# Altium project B106AA.PrjPcb (part 1 of 5)
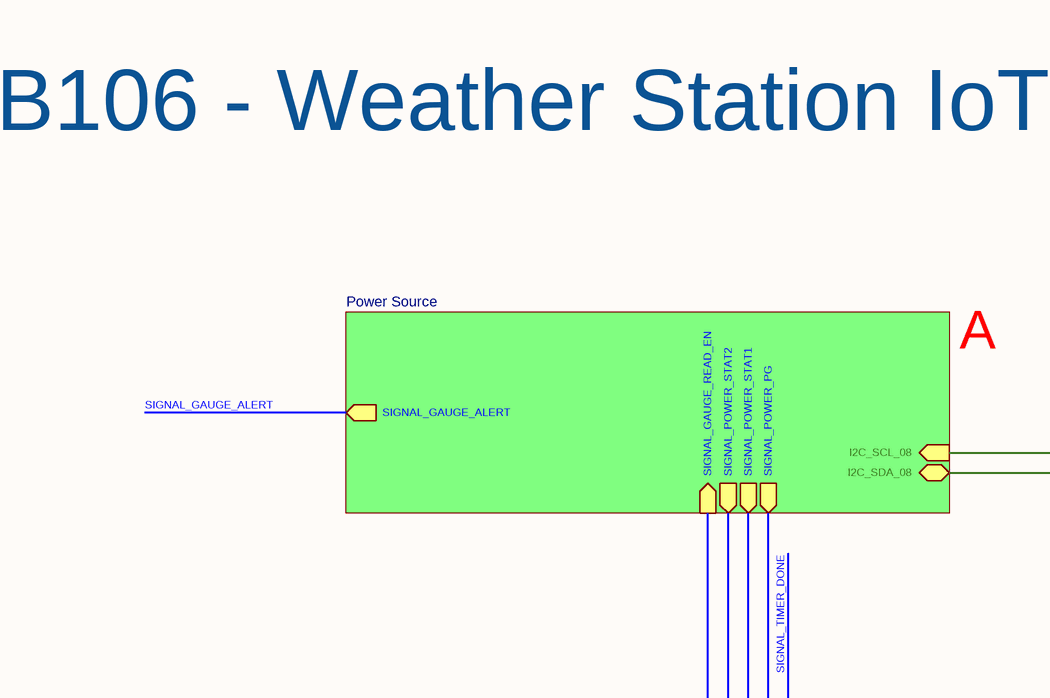
[diagram p0: B106AA Block Diagram.SchDoc, top left]
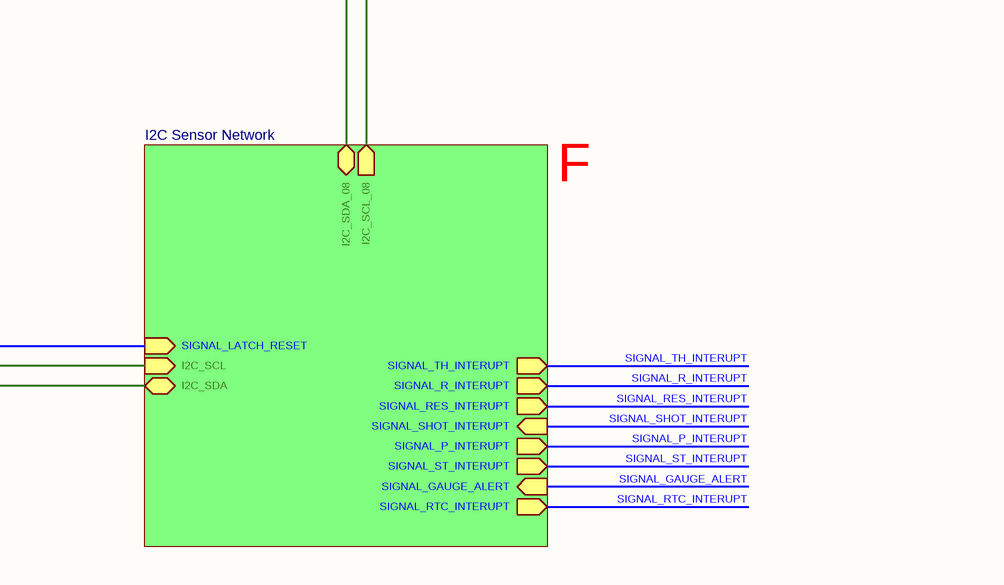
[diagram p1: B106AA Block Diagram.SchDoc, top right]
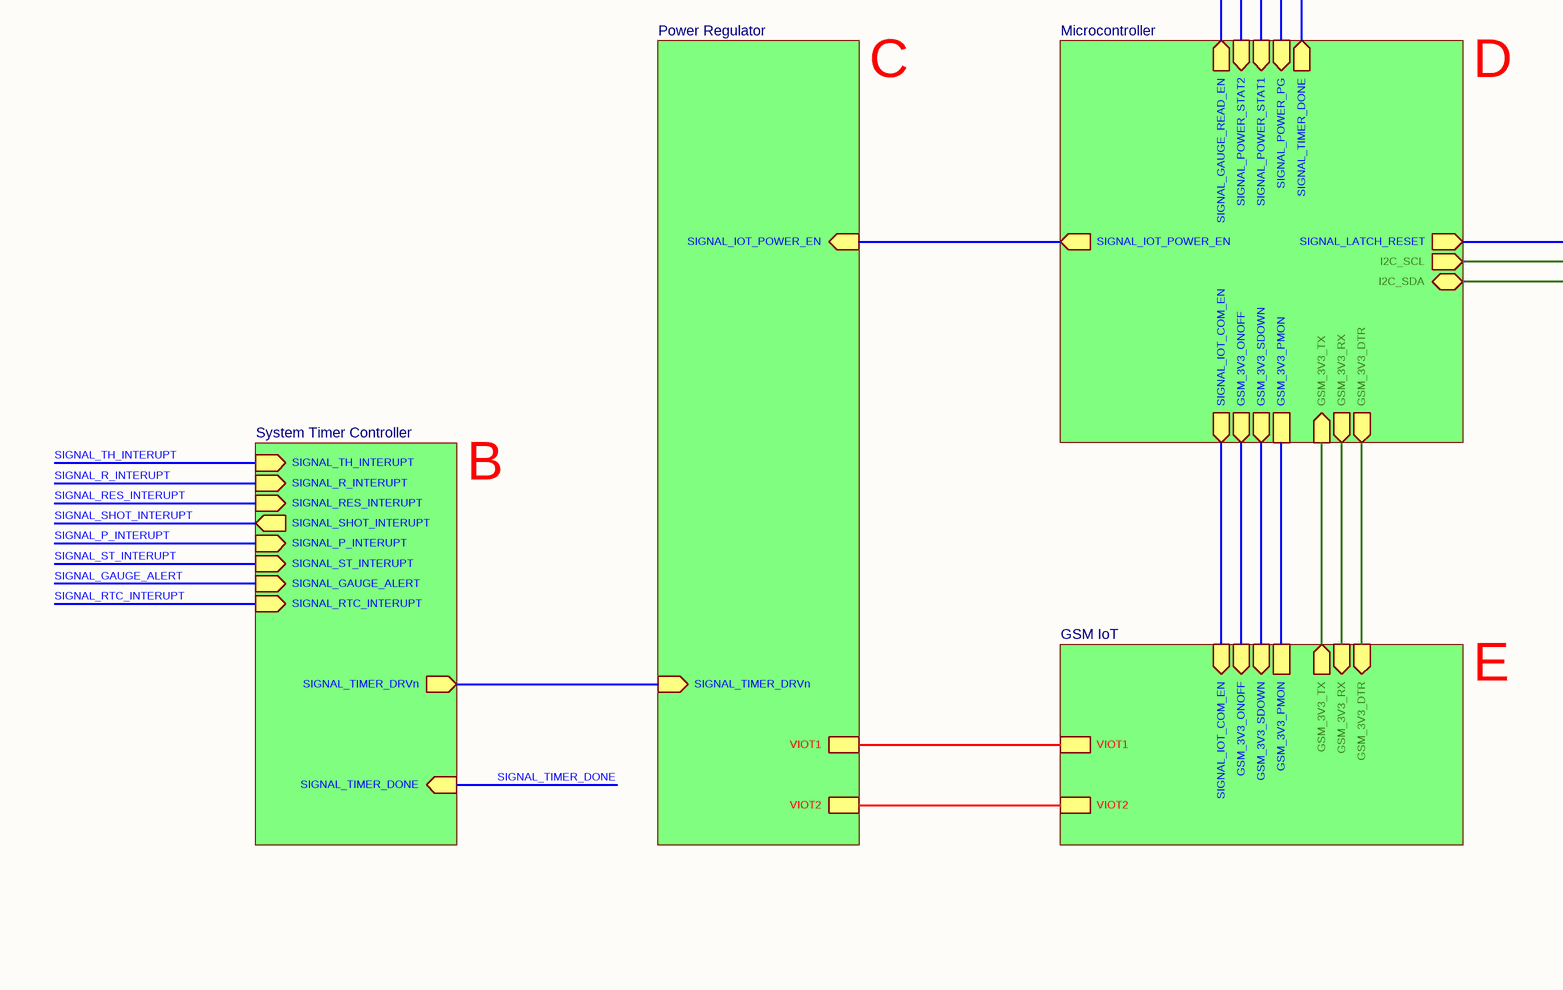
[diagram p2: B106AA Block Diagram.SchDoc, bottom left]
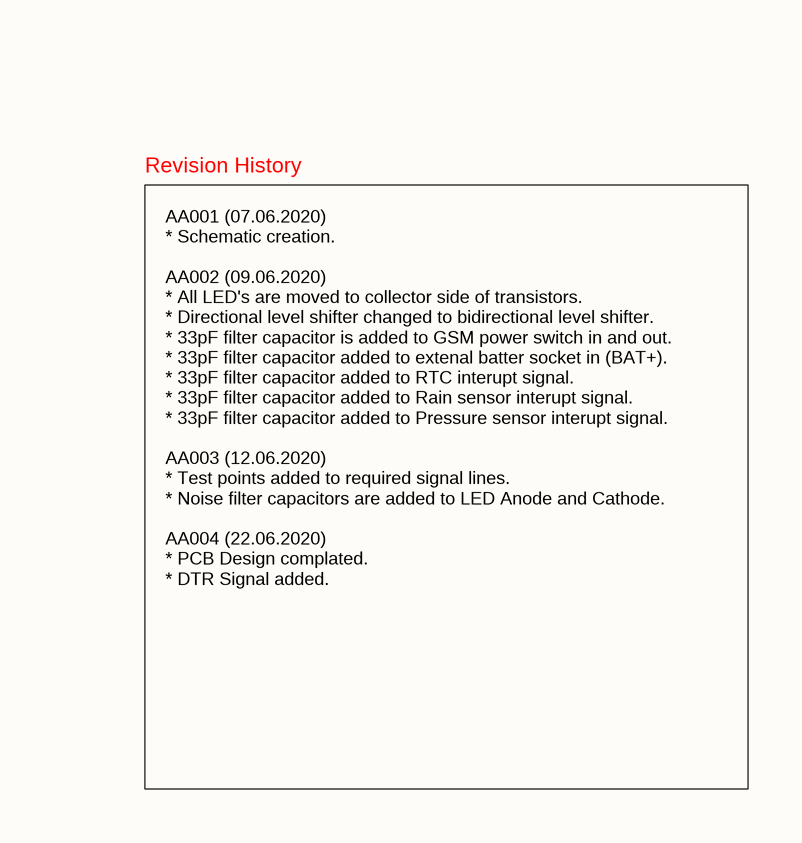
[diagram p3: B106AA Block Diagram.SchDoc, bottom right]
Address1_: Küçük Ýhsaniye Mah.; Address2_: Mýzraklý Sok. No:15; Address3_: Meram / Konya; Address4_: Turkiye; DocumentNumber_: AA005; DocumentNumber_Bulk_: AA005_Bulk; DocumentNumber_Prototype_: AA005_Prototype; Engineer_: Mehmet Günce Akkoyun; link: http://www.ovoo.me; Organization_: Ovoo Electronics; Revision_: B106AA
37 sheets, 383 parts. Net scope: hierarchical (ports join the sheet entries above them; power ports are global).
Board file: B106AA.PcbDoc
Sheets:
  B106AA Block Diagram.SchDoc
    Microcontroller = Microcontroller.SchDoc
      Master MicroController = Master MicroController.SchDoc
      FOTA MicroController Power Trigger = FOTA MicroController Power Trigger.SchDoc
      FOTA MicroController Power Switch = FOTA MicroController Power Switch.SchDoc
      SD Card Selection Multiplexer = SD Card Selection Multiplexer.SchDoc
      SD Card Module = SD Card Module.SchDoc
      FOTA MicroController = FOTA MicroController.SchDoc
      FOTA MicroController Status LED's = FOTA MicroController Status LEDs.SchDoc
    GSM IoT = GSM IoT.SchDoc
      GSM Signal Control = GSM Signal Control.SchDoc
      GE910QUAD GSM Modem = GE910QUAD Modem.SchDoc
      GSM LED Indicators = GSM LED Indicators.SchDoc
      Voltage Translator = Bidirectional Voltage Translator.SchDoc
    System Timer Controller = System Timer.SchDoc
      Timer Managemet = Time Management.SchDoc
      Wake Interupt Logic = System Wake Interupt Logic.SchDoc
      Manuel Wake-up Button = Manuel Wake-up and Latch.SchDoc
    Power Regulator = Power Regulator.SchDoc
      GSM Power Switch IC = GSM Power On-Off Switch IC.SchDoc
      3V3 LDO Regulator (Non-Sleeping) = 3V3 LDO Regulator (NonSleeping).SchDoc
      3V3 LDO Regulator (Sleeping) = 3V3 LDO Regulator (Sleeping).SchDoc
    Power Source = Power Source.SchDoc
      Battery Socket & Portection = Battery Feed and Socket.SchDoc
      Battery Measurement = Battery Measurement.SchDoc
      Battery Charger = Battery Charger.SchDoc
      Buck Boost Converter = Buck Boost Converter.SchDoc
    I2C Sensor Network = I2C Sensor Network.SchDoc
      I2C Multiplexer Switch = I2C Multiplexer.SchDoc
      T/H Sensor Output Socket = TH Sensor Output Socket.SchDoc
      ST Sensor Output Socket = ST Sensor Output Socket.SchDoc
      Pressure Sensor = Pressure Sensor.SchDoc
      Rain Sensor = Capacitive Rain Sensor.SchDoc
      Real Time Clock = Real Time Clock.SchDoc
      I2C I/O Expander = I2C IO Expander.SchDoc
      Reserved Output Socket = Reserved Sensor Output Socket.SchDoc
      Signal Latch = Signal Latch Logic.SchDoc

## Sheet B106AA Block Diagram.SchDoc: Weather Station Block Diagram
size A3; ApprovedBy: Mehmet Günce Akkoyun; CheckedBy: Mehmet Günce Akkoyun; Author: Mehmet Günce Akkoyun; CompanyName: Ovoo Electronics; DrawnBy: Mehmet Günce Akkoyun; Engineer: Mehmet Günce Akkoyun; Organization: Ovoo Electronics; Address1: Küçük Ýhsaniye Mah.; Address2: Mýzraklý Sok. No:15; Address3: Meram / Konya; Address4: Turkiye; DocumentNumber: AA005; Revision: B106AA; SheetNumber: 1; SheetTotal: 37

### Sub-sheets
GSM IoT = GSM IoT.SchDoc: GSM_3V3_PMON, SIGNAL_IOT_COM_EN (in), GSM_3V3_ONOFF (in), GSM_3V3_SDOWN (in), VIOT1, VIOT2, GSM_3V3_TX (out), GSM_3V3_RX (in), GSM_3V3_DTR (in)
I2C Sensor Network = I2C Sensor Network.SchDoc: SIGNAL_ST_INTERUPT (out), SIGNAL_TH_INTERUPT (out), SIGNAL_P_INTERUPT (out), SIGNAL_RES_INTERUPT (out), SIGNAL_R_INTERUPT (out), SIGNAL_GAUGE_ALERT (in), SIGNAL_RTC_INTERUPT (out), SIGNAL_LATCH_RESET (in), SIGNAL_SHOT_INTERUPT (in), I2C_SDA (bidir), I2C_SCL (in), I2C_SDA_08 (bidir), I2C_SCL_08 (out)
Microcontroller = Microcontroller.SchDoc: SIGNAL_IOT_POWER_EN (out), GSM_3V3_PMON, GSM_3V3_ONOFF (out), SIGNAL_IOT_COM_EN (out), GSM_3V3_SDOWN (out), SIGNAL_POWER_STAT2 (in), SIGNAL_POWER_STAT1 (in), SIGNAL_POWER_PG (in), SIGNAL_LATCH_RESET (out), SIGNAL_TIMER_DONE (out), SIGNAL_GAUGE_READ_EN (out), GSM_3V3_TX (in), GSM_3V3_RX (out), I2C_SCL (out), I2C_SDA (bidir), GSM_3V3_DTR (out)
Power Regulator = Power Regulator.SchDoc: VIOT2, SIGNAL_TIMER_DRVn (in), SIGNAL_IOT_POWER_EN (in), VIOT1
Power Source = Power Source.SchDoc: SIGNAL_GAUGE_ALERT (out), SIGNAL_GAUGE_READ_EN (in), SIGNAL_POWER_STAT2 (out), SIGNAL_POWER_STAT1 (out), SIGNAL_POWER_PG (out), I2C_SCL_08 (in), I2C_SDA_08 (bidir)
System Timer Controller = System Timer.SchDoc: SIGNAL_GAUGE_ALERT (in), SIGNAL_ST_INTERUPT (in), SIGNAL_TIMER_DONE (in), SIGNAL_RES_INTERUPT (in), SIGNAL_TH_INTERUPT (in), SIGNAL_R_INTERUPT (in), SIGNAL_P_INTERUPT (in), SIGNAL_TIMER_DRVn (out), SIGNAL_RTC_INTERUPT (in), SIGNAL_SHOT_INTERUPT (out)

### Nets
GSM_3V3_DTR: sheet Microcontroller/GSM_3V3_DTR, sheet GSM IoT/GSM_3V3_DTR
GSM_3V3_ONOFF: sheet Microcontroller/GSM_3V3_ONOFF, sheet GSM IoT/GSM_3V3_ONOFF
GSM_3V3_PMON: sheet Microcontroller/GSM_3V3_PMON, sheet GSM IoT/GSM_3V3_PMON
GSM_3V3_RX: sheet Microcontroller/GSM_3V3_RX, sheet GSM IoT/GSM_3V3_RX
GSM_3V3_SDOWN: sheet Microcontroller/GSM_3V3_SDOWN, sheet GSM IoT/GSM_3V3_SDOWN
GSM_3V3_TX: sheet Microcontroller/GSM_3V3_TX, sheet GSM IoT/GSM_3V3_TX
I2C_SCL: sheet Microcontroller/I2C_SCL, sheet I2C Sensor Network/I2C_SCL
I2C_SCL_08: sheet Power Source/I2C_SCL_08, sheet I2C Sensor Network/I2C_SCL_08
I2C_SDA: sheet Microcontroller/I2C_SDA, sheet I2C Sensor Network/I2C_SDA
I2C_SDA_08: sheet Power Source/I2C_SDA_08, sheet I2C Sensor Network/I2C_SDA_08
SIGNAL_GAUGE_ALERT: sheet System Timer Controller/SIGNAL_GAUGE_ALERT, sheet Power Source/SIGNAL_GAUGE_ALERT, sheet I2C Sensor Network/SIGNAL_GAUGE_ALERT
SIGNAL_IOT_COM_EN: sheet Microcontroller/SIGNAL_IOT_COM_EN, sheet GSM IoT/SIGNAL_IOT_COM_EN
SIGNAL_IOT_POWER_EN: sheet Microcontroller/SIGNAL_IOT_POWER_EN, sheet Power Regulator/SIGNAL_IOT_POWER_EN
SIGNAL_P_INTERUPT: sheet System Timer Controller/SIGNAL_P_INTERUPT, sheet I2C Sensor Network/SIGNAL_P_INTERUPT
SIGNAL_R_INTERUPT: sheet System Timer Controller/SIGNAL_R_INTERUPT, sheet I2C Sensor Network/SIGNAL_R_INTERUPT
SIGNAL_RES_INTERUPT: sheet System Timer Controller/SIGNAL_RES_INTERUPT, sheet I2C Sensor Network/SIGNAL_RES_INTERUPT
SIGNAL_RTC_INTERUPT: sheet System Timer Controller/SIGNAL_RTC_INTERUPT, sheet I2C Sensor Network/SIGNAL_RTC_INTERUPT
SIGNAL_SHOT_INTERUPT: sheet System Timer Controller/SIGNAL_SHOT_INTERUPT, sheet I2C Sensor Network/SIGNAL_SHOT_INTERUPT
SIGNAL_ST_INTERUPT: sheet System Timer Controller/SIGNAL_ST_INTERUPT, sheet I2C Sensor Network/SIGNAL_ST_INTERUPT
SIGNAL_TH_INTERUPT: sheet System Timer Controller/SIGNAL_TH_INTERUPT, sheet I2C Sensor Network/SIGNAL_TH_INTERUPT
SIGNAL_TIMER_DONE: sheet Microcontroller/SIGNAL_TIMER_DONE, sheet System Timer Controller/SIGNAL_TIMER_DONE
SIGNAL_TIMER_DRVn: sheet System Timer Controller/SIGNAL_TIMER_DRVn, sheet Power Regulator/SIGNAL_TIMER_DRVn
VIOT1: sheet GSM IoT/VIOT1, sheet Power Regulator/VIOT1
VIOT2: sheet GSM IoT/VIOT2, sheet Power Regulator/VIOT2
NetC47_1: sheet Microcontroller/SIGNAL_POWER_STAT1, sheet Power Source/SIGNAL_POWER_STAT1
NetC60_1: sheet Microcontroller/SIGNAL_POWER_STAT2, sheet Power Source/SIGNAL_POWER_STAT2
NetC64_1: sheet Microcontroller/SIGNAL_POWER_PG, sheet Power Source/SIGNAL_POWER_PG
NetC93_2: sheet Microcontroller/SIGNAL_LATCH_RESET, sheet I2C Sensor Network/SIGNAL_LATCH_RESET
NetC97_2: sheet Microcontroller/SIGNAL_GAUGE_READ_EN, sheet Power Source/SIGNAL_GAUGE_READ_EN

### Notes on the sheet
- B106 - Weather Station IoT Module
- A
- C
- D
- F
- B
- E
- Revision History
- AA001 (07.06.2020)
  * Schematic creation.
  AA002 (09.06.2020)
  * All LED's are moved to collector side of transistors.
  * Directional level shifter changed to bidirectional level shifter.
  * 33pF filter capacitor is added to GSM power switch in and out.
  * 33pF filter capacitor added to extenal batter socket in (BAT+).
  * 33pF filter capacitor added to RTC interupt signal.
  * 33pF filter capacitor added to Rain sensor interupt signal.
  * 33pF filter capacitor added to Pressure sensor interupt signal.
  AA003 (12.06.2020)
  * Test points added to required signal lines.
  * Noise filter capacitors are added to LED Anode and Cathode.
  AA004 (22.06.2020)
  * PCB Design complated.
  * DTR Signal added.
- Title
- Size:
- Date:
- A3
- Number:
- Time:
- Revision:
- Sheet
- of
- File:

## Sheet Microcontroller.SchDoc: Main Microcontroller & FOTA Microcontroller
size A3; ApprovedBy: Mehmet Günce Akkoyun; CheckedBy: Mehmet Günce Akkoyun; Author: Mehmet Günce Akkoyun; CompanyName: Ovoo Electronics; DrawnBy: Mehmet Günce Akkoyun; Engineer: Mehmet Günce Akkoyun; Organization: Ovoo Electronics; Address1: Küçük Ýhsaniye Mah.; Address2: Mýzraklý Sok. No:15; Address3: Meram / Konya; Address4: Turkiye; DocumentNumber: AA005; Revision: B106AA; SheetNumber: 15; SheetTotal: 37
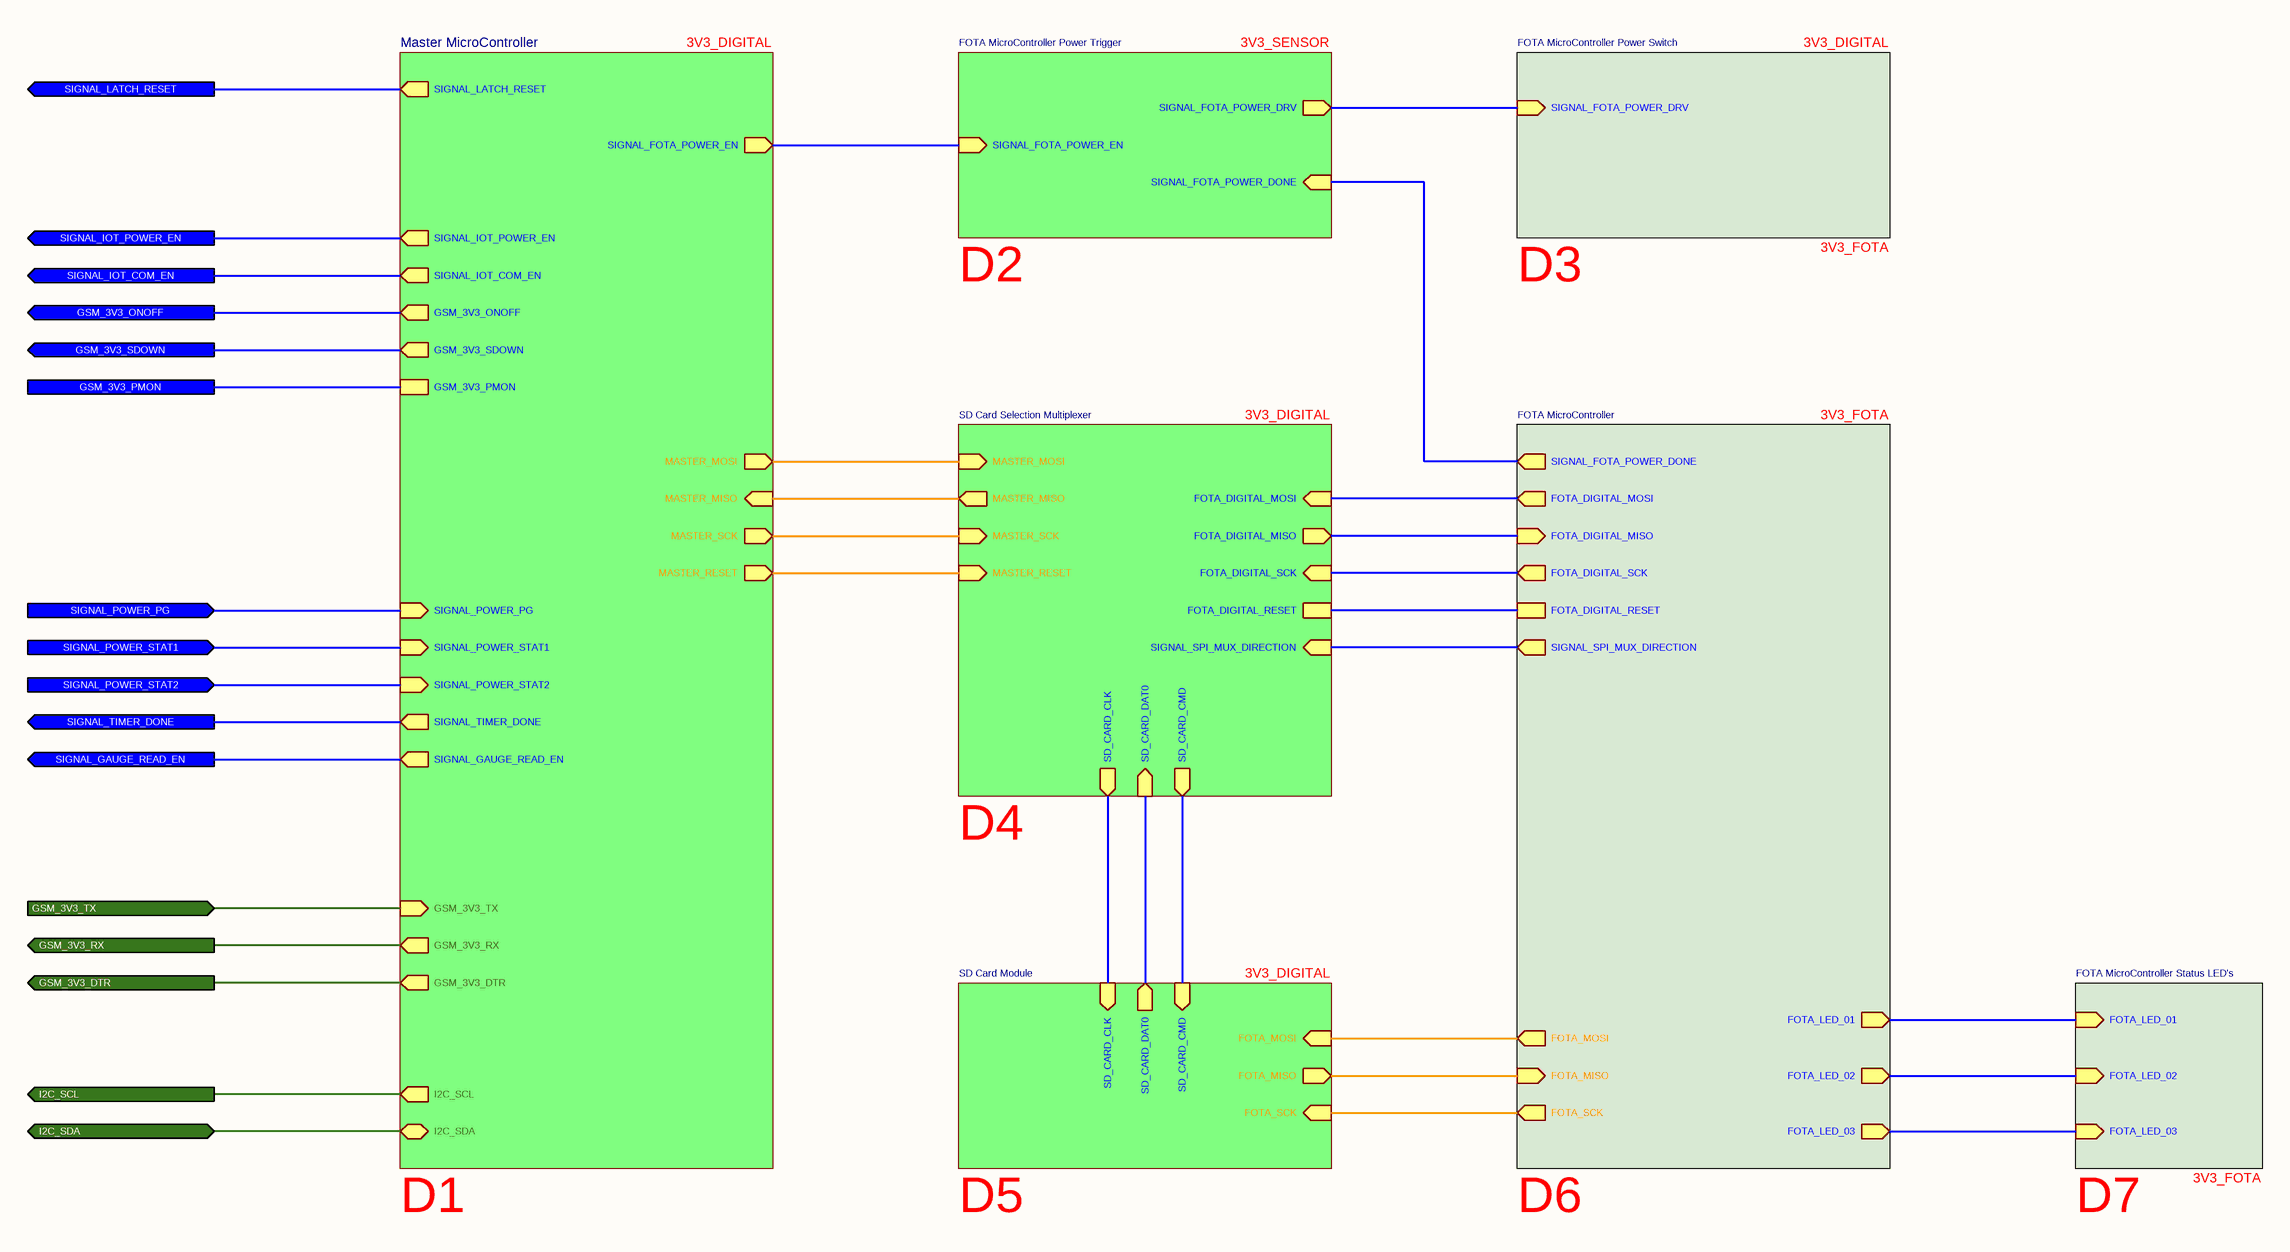
[diagram p4: Microcontroller.SchDoc]

### Sub-sheets
FOTA MicroController = FOTA MicroController.SchDoc: FOTA_LED_02 (out), FOTA_LED_03 (out), FOTA_LED_01 (out), SIGNAL_SPI_MUX_DIRECTION (out), SIGNAL_FOTA_POWER_DONE (out), FOTA_MOSI (out), FOTA_MISO (in), FOTA_SCK (out), FOTA_DIGITAL_SCK (out), FOTA_DIGITAL_MISO (in), FOTA_DIGITAL_RESET, FOTA_DIGITAL_MOSI (out)
FOTA MicroController Power Switch = FOTA MicroController Power Switch.SchDoc: SIGNAL_FOTA_POWER_DRV (in)
FOTA MicroController Power Trigger = FOTA MicroController Power Trigger.SchDoc: SIGNAL_FOTA_POWER_DRV (out), SIGNAL_FOTA_POWER_EN (in), SIGNAL_FOTA_POWER_DONE (in)
FOTA MicroController Status LED's = FOTA MicroController Status LEDs.SchDoc: FOTA_LED_01 (in), FOTA_LED_02 (in), FOTA_LED_03 (in)
Master MicroController = Master MicroController.SchDoc: SIGNAL_FOTA_POWER_EN (out), SIGNAL_IOT_POWER_EN (out), GSM_3V3_SDOWN (out), GSM_3V3_ONOFF (out), GSM_3V3_PMON, SIGNAL_IOT_COM_EN (out), I2C_SCL (out), I2C_SDA (bidir), GSM_3V3_TX (in), GSM_3V3_RX (out), MASTER_MOSI (out), MASTER_RESET (out), MASTER_SCK (out), MASTER_MISO (in), SIGNAL_POWER_PG (in), SIGNAL_POWER_STAT1 (in), SIGNAL_POWER_STAT2 (in), SIGNAL_LATCH_RESET (out), SIGNAL_TIMER_DONE (out), SIGNAL_GAUGE_READ_EN (out), GSM_3V3_DTR (out)
SD Card Module = SD Card Module.SchDoc: SD_CARD_CLK (in), SD_CARD_CMD (in), SD_CARD_DAT0 (out), FOTA_MISO (out), FOTA_MOSI (in), FOTA_SCK (in)
SD Card Selection Multiplexer = SD Card Selection Multiplexer.SchDoc: SIGNAL_SPI_MUX_DIRECTION (in), MASTER_MOSI (in), MASTER_RESET (in), MASTER_MISO (out), MASTER_SCK (in), FOTA_DIGITAL_SCK (in), SD_CARD_CMD (out), FOTA_DIGITAL_MOSI (in), SD_CARD_DAT0 (in), SD_CARD_CLK (out), FOTA_DIGITAL_RESET, FOTA_DIGITAL_MISO (out)

### Ports
GSM_3V3_DTR (out), GSM_3V3_ONOFF (out), GSM_3V3_PMON, GSM_3V3_RX (out), GSM_3V3_SDOWN (out), GSM_3V3_TX (in), I2C_SCL (out), I2C_SDA (bidir), SIGNAL_GAUGE_READ_EN (out), SIGNAL_IOT_COM_EN (out), SIGNAL_IOT_POWER_EN (out), SIGNAL_LATCH_RESET (out), SIGNAL_POWER_PG (in), SIGNAL_POWER_STAT1 (in), SIGNAL_POWER_STAT2 (in), SIGNAL_TIMER_DONE (out)

### Nets
FOTA_DIGITAL_MISO: sheet SD Card Selection Multiplexer/FOTA_DIGITAL_MISO, sheet FOTA MicroController/FOTA_DIGITAL_MISO
FOTA_DIGITAL_MOSI: sheet SD Card Selection Multiplexer/FOTA_DIGITAL_MOSI, sheet FOTA MicroController/FOTA_DIGITAL_MOSI
FOTA_DIGITAL_RESET: sheet SD Card Selection Multiplexer/FOTA_DIGITAL_RESET, sheet FOTA MicroController/FOTA_DIGITAL_RESET
FOTA_DIGITAL_SCK: sheet SD Card Selection Multiplexer/FOTA_DIGITAL_SCK, sheet FOTA MicroController/FOTA_DIGITAL_SCK
FOTA_MISO: sheet SD Card Module/FOTA_MISO, sheet FOTA MicroController/FOTA_MISO
FOTA_MOSI: sheet SD Card Module/FOTA_MOSI, sheet FOTA MicroController/FOTA_MOSI
FOTA_SCK: sheet SD Card Module/FOTA_SCK, sheet FOTA MicroController/FOTA_SCK
GSM_3V3_DTR: port GSM_3V3_DTR, sheet Master MicroController/GSM_3V3_DTR
GSM_3V3_ONOFF: port GSM_3V3_ONOFF, sheet Master MicroController/GSM_3V3_ONOFF
GSM_3V3_PMON: port GSM_3V3_PMON, sheet Master MicroController/GSM_3V3_PMON
GSM_3V3_RX: port GSM_3V3_RX, sheet Master MicroController/GSM_3V3_RX
GSM_3V3_SDOWN: port GSM_3V3_SDOWN, sheet Master MicroController/GSM_3V3_SDOWN
GSM_3V3_TX: port GSM_3V3_TX, sheet Master MicroController/GSM_3V3_TX
I2C_SCL: port I2C_SCL, sheet Master MicroController/I2C_SCL
I2C_SDA: port I2C_SDA, sheet Master MicroController/I2C_SDA
MASTER_MISO: sheet Master MicroController/MASTER_MISO, sheet SD Card Selection Multiplexer/MASTER_MISO
MASTER_MOSI: sheet Master MicroController/MASTER_MOSI, sheet SD Card Selection Multiplexer/MASTER_MOSI
MASTER_RESET: sheet Master MicroController/MASTER_RESET, sheet SD Card Selection Multiplexer/MASTER_RESET
MASTER_SCK: sheet Master MicroController/MASTER_SCK, sheet SD Card Selection Multiplexer/MASTER_SCK
SIGNAL_IOT_COM_EN: port SIGNAL_IOT_COM_EN, sheet Master MicroController/SIGNAL_IOT_COM_EN
SIGNAL_IOT_POWER_EN: port SIGNAL_IOT_POWER_EN, sheet Master MicroController/SIGNAL_IOT_POWER_EN
SIGNAL_TIMER_DONE: port SIGNAL_TIMER_DONE, sheet Master MicroController/SIGNAL_TIMER_DONE
NetC13_2: sheet FOTA MicroController Power Trigger/SIGNAL_FOTA_POWER_DRV, sheet FOTA MicroController Power Switch/SIGNAL_FOTA_POWER_DRV
NetC25_1: sheet FOTA MicroController/FOTA_LED_01, sheet FOTA MicroController Status LED's/FOTA_LED_01
NetC30_2: sheet FOTA MicroController Power Trigger/SIGNAL_FOTA_POWER_DONE, sheet FOTA MicroController/SIGNAL_FOTA_POWER_DONE
NetC39_1: sheet FOTA MicroController/FOTA_LED_02, sheet FOTA MicroController Status LED's/FOTA_LED_02
NetC47_1: port SIGNAL_POWER_STAT1, sheet Master MicroController/SIGNAL_POWER_STAT1
NetC60_1: port SIGNAL_POWER_STAT2, sheet Master MicroController/SIGNAL_POWER_STAT2
NetC64_1: port SIGNAL_POWER_PG, sheet Master MicroController/SIGNAL_POWER_PG
NetC67_1: sheet FOTA MicroController/FOTA_LED_03, sheet FOTA MicroController Status LED's/FOTA_LED_03
NetC69_2: sheet SD Card Selection Multiplexer/SIGNAL_SPI_MUX_DIRECTION, sheet FOTA MicroController/SIGNAL_SPI_MUX_DIRECTION
NetC93_2: port SIGNAL_LATCH_RESET, sheet Master MicroController/SIGNAL_LATCH_RESET
NetC97_2: port SIGNAL_GAUGE_READ_EN, sheet Master MicroController/SIGNAL_GAUGE_READ_EN
NetJ2_3: sheet SD Card Selection Multiplexer/SD_CARD_CMD, sheet SD Card Module/SD_CARD_CMD
NetJ2_5: sheet SD Card Selection Multiplexer/SD_CARD_CLK, sheet SD Card Module/SD_CARD_CLK
NetJ2_7: sheet SD Card Selection Multiplexer/SD_CARD_DAT0, sheet SD Card Module/SD_CARD_DAT0
NetR7_2: sheet Master MicroController/SIGNAL_FOTA_POWER_EN, sheet FOTA MicroController Power Trigger/SIGNAL_FOTA_POWER_EN

### Notes on the sheet
- 3V3_DIGITAL
- 3V3_SENSOR
- 3V3_FOTA
- D2
- D3
- D4
- D1
- D5
- D6
- D7
- Title
- Size:
- Date:
- A3
- Number:
- Time:
- Revision:
- Sheet
- of
- File:

## Sheet Master MicroController.SchDoc: Master MicroController
size A4; ApprovedBy: Mehmet Günce Akkoyun; CheckedBy: Mehmet Günce Akkoyun; Author: Mehmet Günce Akkoyun; CompanyName: Ovoo Electronics; DrawnBy: Mehmet Günce Akkoyun; Engineer: Mehmet Günce Akkoyun; Organization: Ovoo Electronics; Address1: Küçük Ýhsaniye Mah.; Address2: Mýzraklý Sok. No:15; Address3: Meram / Konya; Address4: Turkiye; DocumentNumber: AA005; Revision: B106AA; SheetNumber: 16; SheetTotal: 37
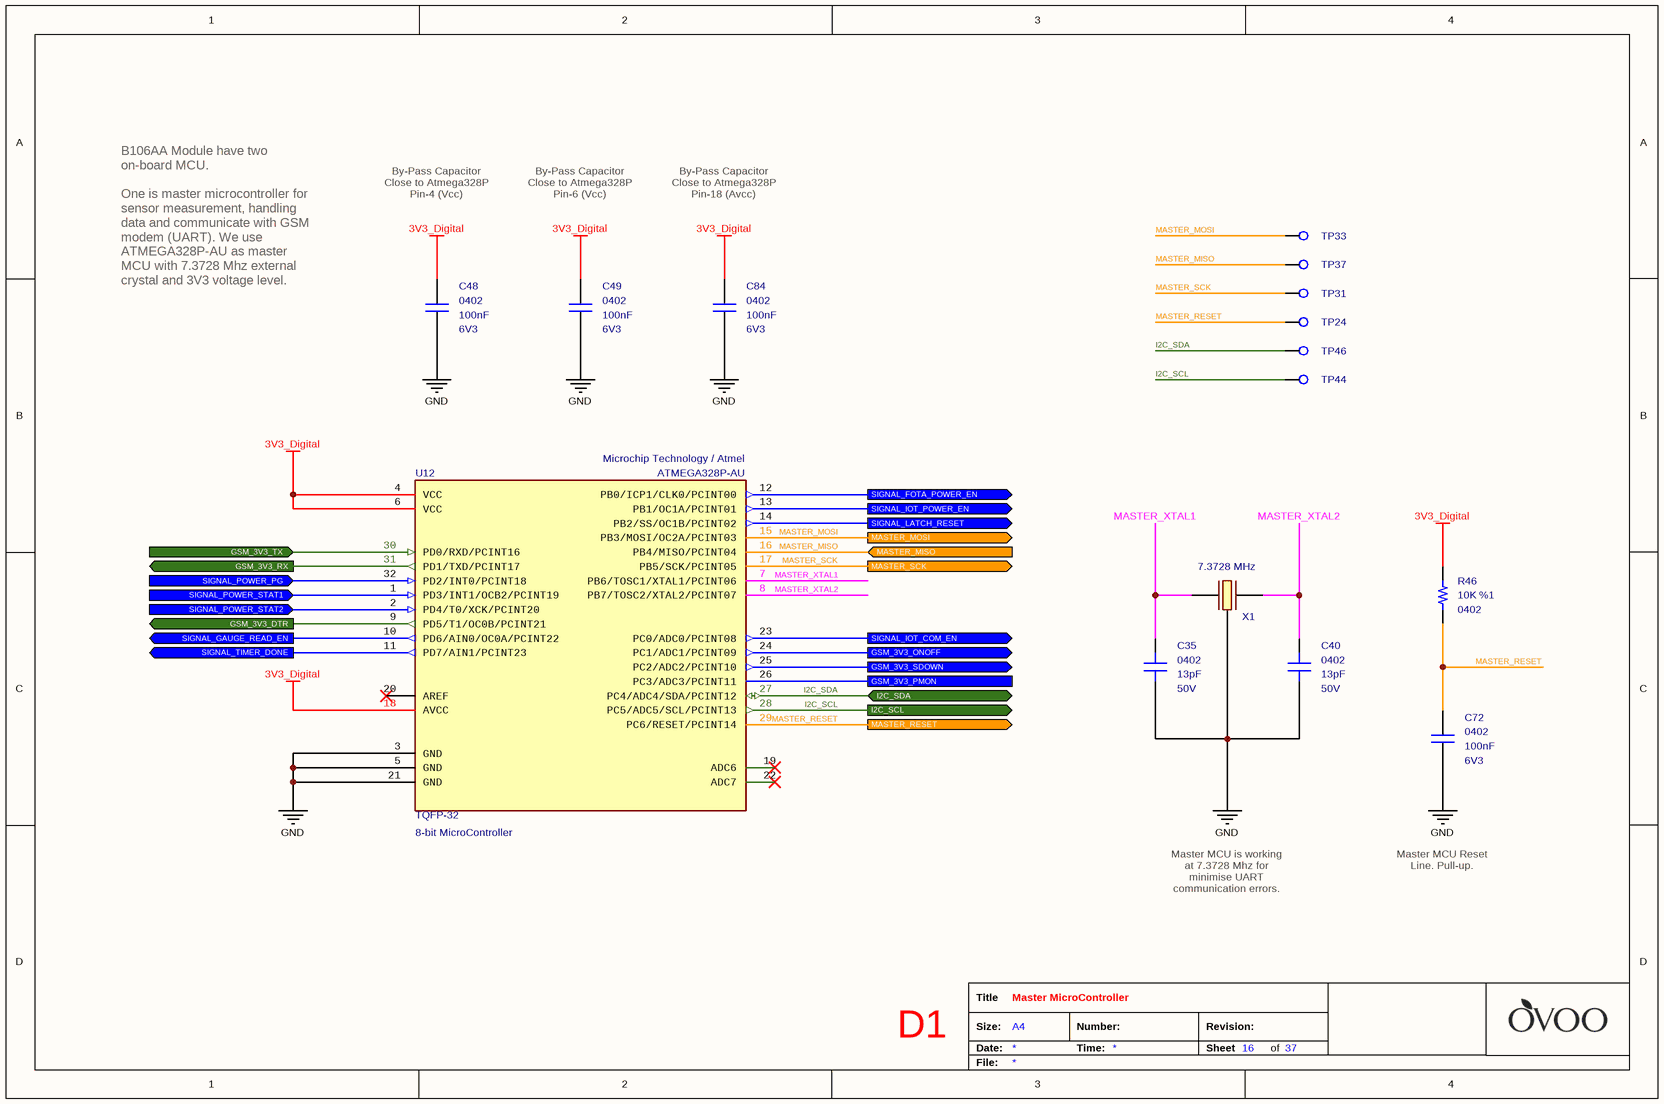
[diagram p5: Master MicroController.SchDoc]

### Parts
C35  value 13pF  Voltage: 50V  Case: 0402  [CAPACITOR_0402]  (hidden comment: Multilayer Ceramic Capacitors)
C40  value 13pF  Voltage: 50V  Case: 0402  [CAPACITOR_0402]  (hidden comment: Multilayer Ceramic Capacitors)
C48  value 100nF  Case: 0402  Voltage: 6V3  [CAPACITOR_0402]  (hidden comment: Multilayer Ceramic Capacitor)
C49  value 100nF  Case: 0402  Voltage: 6V3  [CAPACITOR_0402]  (hidden comment: Multilayer Ceramic Capacitor)
C72  value 100nF  Case: 0402  Voltage: 6V3  [CAPACITOR_0402]  (hidden comment: Multilayer Ceramic Capacitor)
C84  value 100nF  Case: 0402  Voltage: 6V3  [CAPACITOR_0402]  (hidden comment: Multilayer Ceramic Capacitor)
R46  value 10K  Tolerance: %1  Case: 0402  [RESISTOR_0402]  (hidden comment: Thick Film Resistor)
TP24  PCB - Test Point  [Test_Pad - Hole]  (value not drawn)  (no BOM)
TP31  PCB - Test Point  [Test_Pad - Hole]  (value not drawn)  (no BOM)
TP33  PCB - Test Point  [Test_Pad - Hole]  (value not drawn)  (no BOM)
TP37  PCB - Test Point  [Test_Pad - Hole]  (value not drawn)  (no BOM)
TP44  PCB - Test Point  [Test_Pad - Hole]  (value not drawn)  (no BOM)
TP46  PCB - Test Point  [Test_Pad - Hole]  (value not drawn)  (no BOM)
U12  8-bit MicroController  Manufacturer_Part_Number: ATMEGA328P-AU  Manufacturer_Name: Microchip Technology / Atmel  Case: TQFP-32  [TQFP32]
X1  7.3728 MHz  [ABRACON_CRYSTAL]

### Ports
GSM_3V3_DTR (out), GSM_3V3_ONOFF (out), GSM_3V3_PMON, GSM_3V3_RX (out), GSM_3V3_SDOWN (out), GSM_3V3_TX (in), I2C_SCL (out), I2C_SDA (bidir), MASTER_MISO (in), MASTER_MOSI (out), MASTER_RESET (out), MASTER_SCK (out), SIGNAL_FOTA_POWER_EN (out), SIGNAL_GAUGE_READ_EN (out), SIGNAL_IOT_COM_EN (out), SIGNAL_IOT_POWER_EN (out), SIGNAL_LATCH_RESET (out), SIGNAL_POWER_PG (in), SIGNAL_POWER_STAT1 (in), SIGNAL_POWER_STAT2 (in), SIGNAL_TIMER_DONE (out)

### Nets
3V3_Digital: C48.2 C49.2 C84.2 R46.2 U12.4(VCC) U12.6(VCC) U12.18(AVCC)
GND: C35.1 C40.1 C48.1 C49.1 C72.1 C84.1 U12.3(GND) U12.5(GND) U12.21(GND) X1.2(GND)
GSM_3V3_DTR: U12.9(PD5/T1/OC0B/PCINT21) ; port GSM_3V3_DTR
GSM_3V3_ONOFF: U12.24(PC1/ADC1/PCINT09) ; port GSM_3V3_ONOFF
GSM_3V3_PMON: U12.26(PC3/ADC3/PCINT11) ; port GSM_3V3_PMON
GSM_3V3_RX: U12.31(PD1/TXD/PCINT17) ; port GSM_3V3_RX
GSM_3V3_SDOWN: U12.25(PC2/ADC2/PCINT10) ; port GSM_3V3_SDOWN
GSM_3V3_TX: U12.30(PD0/RXD/PCINT16) ; port GSM_3V3_TX
I2C_SCL: TP44.1 U12.28(PC5/ADC5/SCL/PCINT13) ; port I2C_SCL
I2C_SDA: TP46.1 U12.27(PC4/ADC4/SDA/PCINT12) ; port I2C_SDA
MASTER_MISO: TP37.1 U12.16(PB4/MISO/PCINT04) ; port MASTER_MISO
MASTER_MOSI: TP33.1 U12.15(PB3/MOSI/OC2A/PCINT03) ; port MASTER_MOSI
MASTER_RESET: C72.2 R46.1 TP24.1 U12.29(PC6/RESET/PCINT14) ; port MASTER_RESET
MASTER_SCK: TP31.1 U12.17(PB5/SCK/PCINT05) ; port MASTER_SCK
MASTER_XTAL1: C35.2 U12.7(PB6/TOSC1/XTAL1/PCINT06) X1.3(OUT/IN)
MASTER_XTAL2: C40.2 U12.8(PB7/TOSC2/XTAL2/PCINT07) X1.1(IN/OUT)
SIGNAL_IOT_COM_EN: U12.23(PC0/ADC0/PCINT08) ; port SIGNAL_IOT_COM_EN
SIGNAL_IOT_POWER_EN: U12.13(PB1/OC1A/PCINT01) ; port SIGNAL_IOT_POWER_EN
SIGNAL_TIMER_DONE: U12.11(PD7/AIN1/PCINT23) ; port SIGNAL_TIMER_DONE
NetC47_1: U12.1(PD3/INT1/OCB2/PCINT19) ; port SIGNAL_POWER_STAT1
NetC60_1: U12.2(PD4/T0/XCK/PCINT20) ; port SIGNAL_POWER_STAT2
NetC64_1: U12.32(PD2/INT0/PCINT18) ; port SIGNAL_POWER_PG
NetC93_2: U12.14(PB2/SS/OC1B/PCINT02) ; port SIGNAL_LATCH_RESET
NetC97_2: U12.10(PD6/AIN0/OC0A/PCINT22) ; port SIGNAL_GAUGE_READ_EN
NetR7_2: U12.12(PB0/ICP1/CLK0/PCINT00) ; port SIGNAL_FOTA_POWER_EN

Not connected (* = marked no-connect by the designer): U12 19(ADC6)* 20(AREF)* 22(ADC7)*; X1 4(GND)

### Notes on the sheet
- By-Pass Capacitor
  Close to Atmega328P
  Pin-4 (Vcc)
- By-Pass Capacitor
  Close to Atmega328P
  Pin-6 (Vcc)
- By-Pass Capacitor
  Close to Atmega328P
  Pin-18 (Avcc)
- B106AA Module have two on-board MCU.
  One is master microcontroller for sensor measurement, handling data and communicate with GSM modem (UART). We use ATMEGA328P-AU as master MCU with 7.3728 Mhz external crystal and 3V3 voltage level.
- Master MCU is working at 7.3728 Mhz for minimise UART communication errors.
- Master MCU Reset Line. Pull-up.
- D1
- Title
- Size:
- Date:
- A4
- Number:
- Time:
- Revision:
- Sheet
- of
- File:

### Library data of the parts
C35 C40 = Capacitor - 13pF [0402-50V): Capacitor - 13pF [0402] (Ceramic); Manufacturer_Name: Kemet; Manufacturer_Part_Number: CBR04C130F5GAC; Dielectric: C0G; Tolerance: 1%; Height: 0.55mm; Mouser_Part_Number: 80-CBR04C130F5GAC; ROHS: Yes; Weight: 0.65mg; ComponentLink1Description: DataSheet; ComponentLink1URL: http://www.kemet.com/Lists/ProductCatalog/Attachments/490/KEM_C1030_CBR_SMD.pdf; ComponentLink2Description: Mouser; ComponentLink2URL: http://www.mouser.com/Search/ProductDetail.aspx?qs=kSX8PZDGYstn%252bRHasf81FA%3d%3d; Supplier 1: Mouser; Supplier 2: Farnell; Supplier 3: Digi-Key; Supplier Part Number 3: 399-8812-1-ND; Supplier Part Number 2: 2773390; Supplier Part Number 1: 80-CBR04C130F5GAC
C48 C49 C72 C84 = Capacitor - 100nF [0402-6V3]: Capacitor - 100nF [0402-6V3] (Ceramic); Manufacturer_Name: AVX; Manufacturer_Part_Number: 04026D104KAT4A; Dielectric: X5R; Tolerance: %10; Height: 0.25mm; Mouser_Part_Number: 581-04026D104KAT4A; ComponentLink1Description: Mouser; ComponentLink1URL: https://www.mouser.com.tr/ProductDetail/AVX/04026D104KAT4A?qs=sGAEpiMZZMs0AnBnWHyRQPg4iYkCw7IMED%2F4kpqgf7w%3D; ComponentLink2Description: DataSheet; ComponentLink2URL: https://www.mouser.com.tr/datasheet/2/40/cx5r-776519.pdf; ROHS: Yes; Maximum Operating Temperature: +85; Minimum Operating Temperature: -55; Supplier 1: Avnet; Supplier Part Number 1: 04026D104KAT4A
R46 = Resistor - 10K: Thick Film Resistors - SMD 1/16 W 10 Kohms 1%; Manufacturer_Name: Vishay; Manufacturer_Part_Number: CRCW040210K0FKED; Height: 0.4mm; Mouser_Part_Number: 71-CRCW0402-10K-E3; ComponentLink1Description: DataSheet; ComponentLink1URL: https://www.mouser.com.tr/datasheet/2/427/dcrcwe3-1762152.pdf; ComponentLink2Description: Mouser; ComponentLink2URL: https://www.mouser.com.tr/ProductDetail/Vishay-Dale/CRCW040210K0FKED?qs=sGAEpiMZZMu61qfTUdNhG2DpbjADlD3GcalbOv9utCY%3D; Supplier 1: Mouser; Supplier 2: Digi-Key; Supplier Part Number 1: 71-CRCW040210K0FKEDH; Supplier Part Number 2: 541-10.0KYCT-ND
TP24 TP31 TP33 TP37 TP44 TP46 = PCB - Test Point: Test Point
U12 = IC - ATMEGA328P: 8-bit Microcontrollers - MCU 32KB In-system Flash 20MHz 1.8V-5.5V; Supply Voltage - Min: 1.8V; Supply Voltage - Max: 5.5V; Height: 1mm; Mouser_Part_Number: 556-ATMEGA328P-AU; ComponentLink1Description: DataSheet; ComponentLink1URL: http://ww1.microchip.com/downloads/en/DeviceDoc/ATmega48A-PA-88A-PA-168A-PA-328-P-DS-DS40002061A.pdf; ROHS: Yes; Minimum Operating Temperature: -40; Maximum Operating Temperature: +85; ComponentLink2Description: Mouser; ComponentLink2URL: https://www.mouser.com.tr/ProductDetail/Microchip-Technology-Atmel/ATMEGA328P-AU?qs=sGAEpiMZZMtVoztFdqDXO3RbBx7FKCmV; ComponentLink3Description: ProductPage; ComponentLink3URL: https://www.microchip.com/wwwproducts/en/ATmega328p; Supplier 1: Avnet; Supplier 2: Mouser; Supplier 3: Arrow; Supplier 4: Digi-Key; Supplier Part Number 1: ATMEGA328P-AU; Supplier Part Number 2: 556-ATMEGA328P-AU; Supplier Part Number 3: ATMEGA328P-AU; Supplier Part Number 4: ATMEGA328P-AU-ND
X1 = Crystal - 7.3728 MHz (Abracon): Crystals 7.3728MHz 18pF -40C +85C; Manufacturer_Part_Number: ABMM2-7.3728MHZ-E2-T; ESR: 150 Ohms; Frequency Stability: 20 ppm; Height: 1.2 mm; Manufacturer_Name: ABRACON; Mouser_Part_Number: 815-ABMM2-7.3-E2-T; Frequency: 7.3728 MHz; Maximum Operating Temperature: +70; Minimum Operating Temperature: -20; ROHS: Yes; Tolerance: 20 ppm; ComponentLink1Description: DataSheet; ComponentLink1URL: https://www.ecsxtal.com/store/pdf/csm-8mr.pdf; ComponentLink2Description: Mouser; ComponentLink2URL: https://www.mouser.com/Search/Refine.aspx?Keyword=520-7.3-18-20BM-JENT; Supplier 1: Mouser; Supplier 2: Arrow; Supplier Part Number 2: ABMM2-7.3728MHZ-E2-T; Supplier Part Number 1: 815-ABMM2-7.3-E2-T

## Sheet FOTA MicroController Power Trigger.SchDoc: FOTA MicroController Latched Power Trigger
size A4; ApprovedBy: Mehmet Günce Akkoyun; CheckedBy: Mehmet Günce Akkoyun; Author: Mehmet Günce Akkoyun; CompanyName: Ovoo Electronics; DrawnBy: Mehmet Günce Akkoyun; Engineer: Mehmet Günce Akkoyun; Organization: Ovoo Electronics; Address1: Küçük Ýhsaniye Mah.; Address2: Mýzraklý Sok. No:15; Address3: Meram / Konya; Address4: Turkiye; DocumentNumber: AA005; Revision: B106AA; SheetNumber: 17; SheetTotal: 37
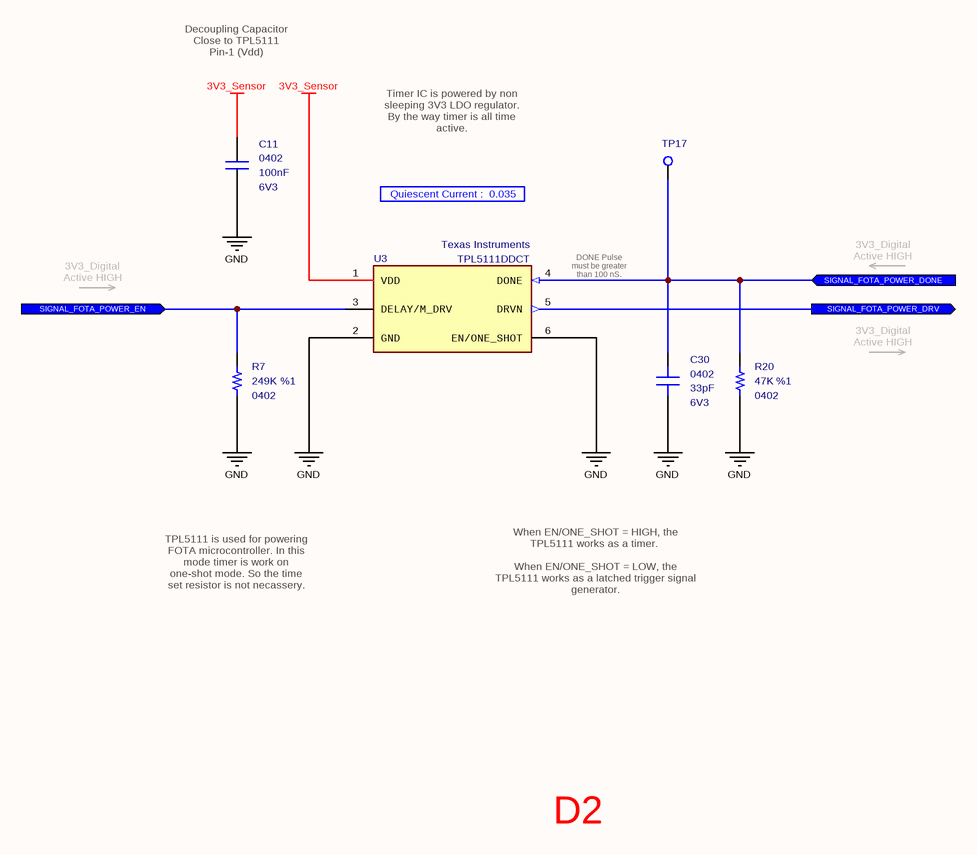
[diagram p6: FOTA MicroController Power Trigger.SchDoc]

### Parts
C11  value 100nF  Case: 0402  Voltage: 6V3  [CAPACITOR_0402]  (hidden comment: Multilayer Ceramic Capacitor)
C30  value 33pF  Case: 0402  Voltage: 6V3  [CAPACITOR_0402]  (hidden comment: Multilayer Ceramic Capacitor)
R7  value 249K  Tolerance: %1  Case: 0402  [RESISTOR_0402]  (hidden comment: Thick Film Resistor)
R20  value 47K  Tolerance: %1  Case: 0402  [RESISTOR_0402]  (hidden comment: Thick Film Resistor)
TP17  PCB - Test Point  [Test_Pad - Hole]  (value not drawn)  (no BOM)
U3  Manufacturer _Part_Number: TPL5111DDCT  Manufacturer_Name: Texas Instruments  [SOT-23-6]  (hidden comment: Nanopower Timer IC)

### Ports
SIGNAL_FOTA_POWER_DONE (in), SIGNAL_FOTA_POWER_DRV (out), SIGNAL_FOTA_POWER_EN (in)

### Nets
3V3_Sensor: C11.2 U3.1(VDD)
GND: C11.1 C30.1 R7.1 R20.1 U3.2(GND) U3.6(EN/ONE_SHOT)
NetC13_2: U3.5(DRVN) ; port SIGNAL_FOTA_POWER_DRV
NetC30_2: C30.2 R20.2 TP17.1 U3.4(DONE) ; port SIGNAL_FOTA_POWER_DONE
NetR7_2: R7.2 U3.3(DELAY/M_DRV) ; port SIGNAL_FOTA_POWER_EN

### Notes on the sheet
- Decoupling Capacitor
  Close to TPL5111
  Pin-1 (Vdd)
- Quiescent Current :  0.035 µA
- Timer IC is powered by non sleeping 3V3 LDO regulator. By the way timer is all time active.
- 3V3_Digital
  Active HIGH
- (near U3) DONE Pulse must be greater than 100 nS.
- TPL5111 is used for powering FOTA microcontroller. In this mode timer is work on one-shot mode. So the time set resistor is not necassery.
- When EN/ONE_SHOT = HIGH, the TPL5111 works as a timer.
  When EN/ONE_SHOT = LOW, the TPL5111 works as a latched trigger signal generator.
- D2
- Title
- Size:
- Date:
- A4
- Number:
- Time:
- Revision:
- Sheet
- of
- File:

### Library data of the parts
C11 = Capacitor - 100nF [0402-6V3]: as C48 on sheet Master MicroController; Height: 0.25mm; Mouser_Part_Number: 581-04026D104KAT4A; ComponentLink1Description: Mouser; ComponentLink1URL: https://www.mouser.com.tr/ProductDetail/AVX/04026D104KAT4A?qs=sGAEpiMZZMs0AnBnWHyRQPg4iYkCw7IMED%2F4kpqgf7w%3D; ComponentLink2Description: DataSheet; ComponentLink2URL: https://www.mouser.com.tr/datasheet/2/40/cx5r-776519.pdf; ROHS: Yes; Maximum Operating Temperature: +85; Minimum Operating Temperature: -55; Supplier 1: Avnet; Supplier Part Number 1: 04026D104KAT4A
C30 = Capacitor - 33pF [0402-6V3]: Capacitor - 33pF [0402] (Ceramic); Manufacturer_Name: Kemet; Manufacturer_Part_Number: C0402C330J9RACAUTO; Dielectric: X7R; Tolerance: 10%; Height: 0.5mm; Mouser_Part_Number: 80-C0402C330J9RAUTO; Maximum Operating Temperature: +125; Minimum Operating Temperature: -55; ROHS: Yes; ComponentLink1Description: DataSheet; ComponentLink1URL: https://api.kemet.com/component-edge/download/datasheet/C0402C330J9RACAUTO.pdf; ComponentLink2Description: Mouser; ComponentLink2URL: https://www.mouser.com/Search/Refine.aspx?Keyword=80-C0402C330J9RAUTO; Supplier 1: Mouser; Supplier Part Number 1: 80-C0402C330J9RAUTO
R7 = Resistor - 249K: Thick Film Resistors - SMD 1/16 W 249 Kohms 1%; Manufacturer_Name: Vishay; Manufacturer_Part_Number: CRCW0402249KFKED; Height: 0.35mm; Mouser_Part_Number: 71-CRCW0402-249K-E3; ComponentLink1Description: DataSheet; ComponentLink1URL: https://www.mouser.com.tr/datasheet/2/427/dcrcwe3-1762152.pdf; ComponentLink2Description: Mouser; ComponentLink2URL: https://www.mouser.com.tr/ProductDetail/Vishay-Dale/CRCW0402249KFKED?qs=sGAEpiMZZMu61qfTUdNhG2DpbjADlD3GEiYBObatoAI%3D; Supplier 1: Mouser; Supplier 2: Digi-Key; Supplier Part Number 1: 71-CRCW0402-249K-E3; Supplier Part Number 2: 541-249KLCT-ND
R20 = Resistor - 47K: Thick Film Resistors - SMD 1/16 W 47 Kohms 1%; Manufacturer_Name: Vishay; Manufacturer_Part_Number: CRCW040247K0FKED; Height: 0.4mm; Mouser_Part_Number: 71-CRCW0402-47K-E3; ComponentLink1Description: DataSheet; ComponentLink1URL: https://www.mouser.com.tr/datasheet/2/427/dcrcwe3-1762152.pdf; ComponentLink2Description: Mouser; ComponentLink2URL: https://www.mouser.com.tr/ProductDetail/Vishay-Dale/CRCW040247K0FKED?qs=sGAEpiMZZMu61qfTUdNhG2DpbjADlD3GL%252B3h1elTxqU%3D; Supplier 1: Mouser; Supplier 2: Digi-Key; Supplier Part Number 1: 71-CRCW040247K0FKEDH; Supplier Part Number 2: 541-47.0KYCT-ND
TP17 = PCB - Test Point: Test Point
U3 = IC - TPL5111: Timers & Support Products Ultra Low Power System Timer (35 nA) for Power Gating in duty cycled applications.; Supply Voltage - Min: 1.8V; Supply Voltage - Max: 5.5V; Height: 1.1mm; ROHS: Yes; Minimum Operating Temperature: -40; Maximum Operating Temperature: +105; ComponentLink1Description: DataSheet; ComponentLink1URL: http://www.ti.com/general/docs/suppproductinfo.tsp?distId=26&gotoUrl=http%3A%2F%2Fwww.ti.com%2Flit%2Fgpn%2Ftpl5111; Mouser_Part_Number: 595-TPL5111DDCT; ComponentLink2Description: Mouser; ComponentLink2URL: https://www.mouser.com/Search/Refine.aspx?Keyword=595-TPL5111DDCT; Supplier 1: Mouser; Supplier 2: Arrow; Supplier 3: Farnell; Supplier 4: Digi-Key; Supplier 5: Newark; Supplier Part Number 1: 595-TPL5111DDCT; Supplier Part Number 2: TPL5111DDCT; Supplier Part Number 3: 3006922; Supplier Part Number 4: 296-42621-1-ND; Supplier Part Number 5: 28AH5709

## Sheet FOTA MicroController Power Switch.SchDoc: FOTA MicroController Power Switch
size A4; ApprovedBy: Mehmet Günce Akkoyun; CheckedBy: Mehmet Günce Akkoyun; Author: Mehmet Günce Akkoyun; CompanyName: Ovoo Electronics; DrawnBy: Mehmet Günce Akkoyun; Engineer: Mehmet Günce Akkoyun; Organization: Ovoo Electronics; Address1: Küçük Ýhsaniye Mah.; Address2: Mýzraklý Sok. No:15; Address3: Meram / Konya; Address4: Turkiye; DocumentNumber: AA005; Revision: B106AA; SheetNumber: 18; SheetTotal: 37
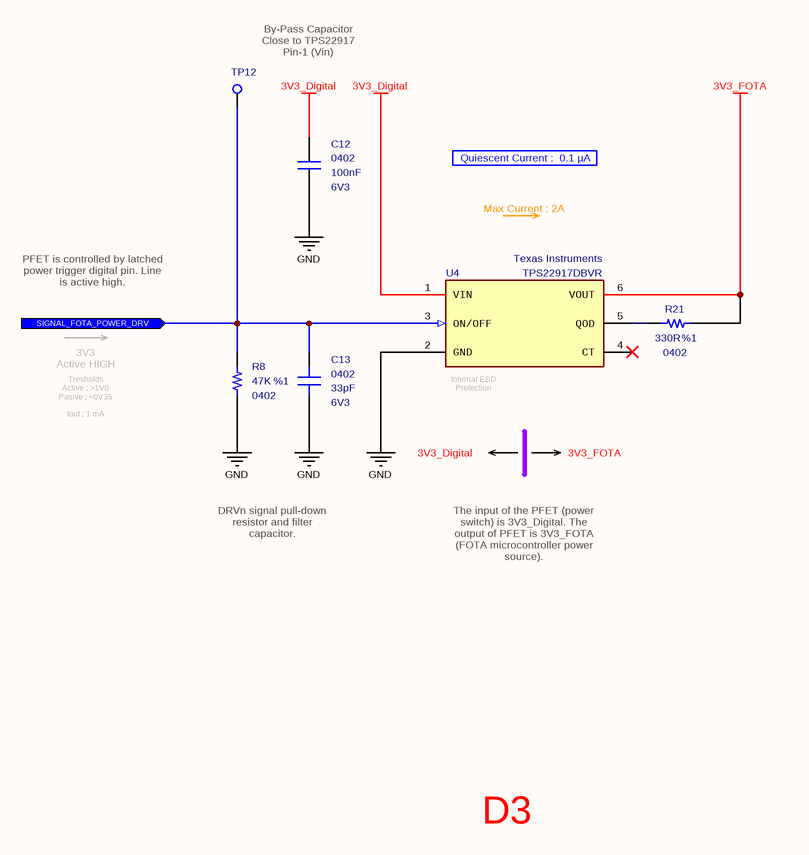
[diagram p7: FOTA MicroController Power Switch.SchDoc]

### Parts
C12  value 100nF  Case: 0402  Voltage: 6V3  [CAPACITOR_0402]  (hidden comment: Multilayer Ceramic Capacitor)
C13  value 33pF  Case: 0402  Voltage: 6V3  [CAPACITOR_0402]  (hidden comment: Multilayer Ceramic Capacitor)
R8  value 47K  Tolerance: %1  Case: 0402  [RESISTOR_0402]  (hidden comment: Thick Film Resistor)
R21  value 330R  Tolerance: %1  Case: 0402  [RESISTOR_0402]  (hidden comment: Thick Film Resistor)
TP12  PCB - Test Point  [Test_Pad - Hole]  (value not drawn)  (no BOM)
U4  Manufacturer_Part_Number: TPS22917DBVR  Manufacturer_Name: Texas Instruments  [SOT-23-6]  (hidden comment: Power Switch)

### Ports
SIGNAL_FOTA_POWER_DRV (in)

### Nets
3V3_Digital: C12.1 U4.1(VIN)
3V3_FOTA: R21.1 U4.6(VOUT)
GND: C12.2 C13.1 R8.1 U4.2(GND)
NetC13_2: C13.2 R8.2 TP12.1 U4.3(ON/OFF) ; port SIGNAL_FOTA_POWER_DRV
NetR21_2: R21.2 U4.5(QOD)

Not connected (* = marked no-connect by the designer): U4 4(CT)*

### Notes on the sheet
- (near TP12) By-Pass Capacitor
  Close to TPS22917
  Pin-1 (Vin)
- Quiescent Current :  0.1 µA
- Max Current : 2A
- PFET is controlled by latched power trigger digital pin. Line is active high.
- 3V3
  Active HIGH
- (near U4) Internal ESD Protection
- Tresholds
  Active : >1V0
  Pasive : <0V35
  Iout : 1 mA
- 3V3_Digital
- 3V3_FOTA
- DRVn signal pull-down resistor and filter capacitor.
- The input of the PFET (power switch) is 3V3_Digital. The output of PFET is 3V3_FOTA (FOTA microcontroller power source).
- D3
- Title
- Size:
- Date:
- A4
- Number:
- Time:
- Revision:
- Sheet
- of
- File:

### Library data of the parts
C12 = Capacitor - 100nF [0402-6V3]: as C48 on sheet Master MicroController; Height: 0.25mm; Mouser_Part_Number: 581-04026D104KAT4A; ComponentLink1Description: Mouser; ComponentLink1URL: https://www.mouser.com.tr/ProductDetail/AVX/04026D104KAT4A?qs=sGAEpiMZZMs0AnBnWHyRQPg4iYkCw7IMED%2F4kpqgf7w%3D; ComponentLink2Description: DataSheet; ComponentLink2URL: https://www.mouser.com.tr/datasheet/2/40/cx5r-776519.pdf; ROHS: Yes; Maximum Operating Temperature: +85; Minimum Operating Temperature: -55; Supplier 1: Avnet; Supplier Part Number 1: 04026D104KAT4A
C13 = Capacitor - 33pF [0402-6V3]: as C30 on sheet FOTA MicroController Power Trigger; Height: 0.5mm; Mouser_Part_Number: 80-C0402C330J9RAUTO; Maximum Operating Temperature: +125; Minimum Operating Temperature: -55; ROHS: Yes; ComponentLink1Description: DataSheet; ComponentLink1URL: https://api.kemet.com/component-edge/download/datasheet/C0402C330J9RACAUTO.pdf; ComponentLink2Description: Mouser; ComponentLink2URL: https://www.mouser.com/Search/Refine.aspx?Keyword=80-C0402C330J9RAUTO; Supplier 1: Mouser; Supplier Part Number 1: 80-C0402C330J9RAUTO
R8 = Resistor - 47K: as R20 on sheet FOTA MicroController Power Trigger; Height: 0.4mm; Mouser_Part_Number: 71-CRCW0402-47K-E3; ComponentLink1Description: DataSheet; ComponentLink1URL: https://www.mouser.com.tr/datasheet/2/427/dcrcwe3-1762152.pdf; ComponentLink2Description: Mouser; ComponentLink2URL: https://www.mouser.com.tr/ProductDetail/Vishay-Dale/CRCW040247K0FKED?qs=sGAEpiMZZMu61qfTUdNhG2DpbjADlD3GL%252B3h1elTxqU%3D; Supplier 1: Mouser; Supplier 2: Digi-Key; Supplier Part Number 1: 71-CRCW040247K0FKEDH; Supplier Part Number 2: 541-47.0KYCT-ND
R21 = Resistor - 330R: Thick Film Resistors - SMD 1/16 W 330 Ohm 1%; Manufacturer_Name: Vishay; Manufacturer_Part_Number: CRCW0402330RFKED; Height: 0.4mm; Mouser_Part_Number: 71-CRCW0402-330-E3; ComponentLink1Description: DataSheet; ComponentLink1URL: https://www.mouser.com.tr/datasheet/2/427/dcrcwe3-1762152.pdf; ComponentLink2Description: Mouser; ComponentLink2URL: https://www.mouser.com.tr/ProductDetail/Vishay-Dale/CRCW0402330RFKED?qs=sGAEpiMZZMu61qfTUdNhG2DpbjADlD3GGS6SwBlLi5Q%3D; Supplier 1: Mouser; Supplier 2: Digi-Key; Supplier Part Number 2: 541-330LCT-ND; Supplier Part Number 1: 71-CRCW0402-330-E3
TP12 = PCB - Test Point: Test Point
U4 = IC - TPS22917DBVR: Power Switch MosFet; Height: 1.45mm; Mouser_Part_Number: 595-TPS22917DBVR; ComponentLink1Description: DataSheet; ComponentLink1URL: http://www.ti.com/lit/gpn/tps22917; ComponentLink2Description: Mouser; ComponentLink2URL: https://www.mouser.com/Search/Refine.aspx?Keyword=595-TPS22917DBVR; Supplier 1: Mouser; Supplier 2: Digi-Key; Supplier Part Number 1: 595-TPS22917DBVR; Supplier Part Number 2: 296-50498-1-ND

## Sheet SD Card Selection Multiplexer.SchDoc: SD/ICSP Selection Multiplexer
size A4; ApprovedBy: Mehmet Günce Akkoyun; CheckedBy: Mehmet Günce Akkoyun; Author: Mehmet Günce Akkoyun; CompanyName: Ovoo Electronics; DrawnBy: Mehmet Günce Akkoyun; Engineer: Mehmet Günce Akkoyun; Organization: Ovoo Electronics; Address1: Küçük Ýhsaniye Mah.; Address2: Mýzraklý Sok. No:15; Address3: Meram / Konya; Address4: Turkiye; DocumentNumber: AA005; Revision: B106AA; SheetNumber: 19; SheetTotal: 37
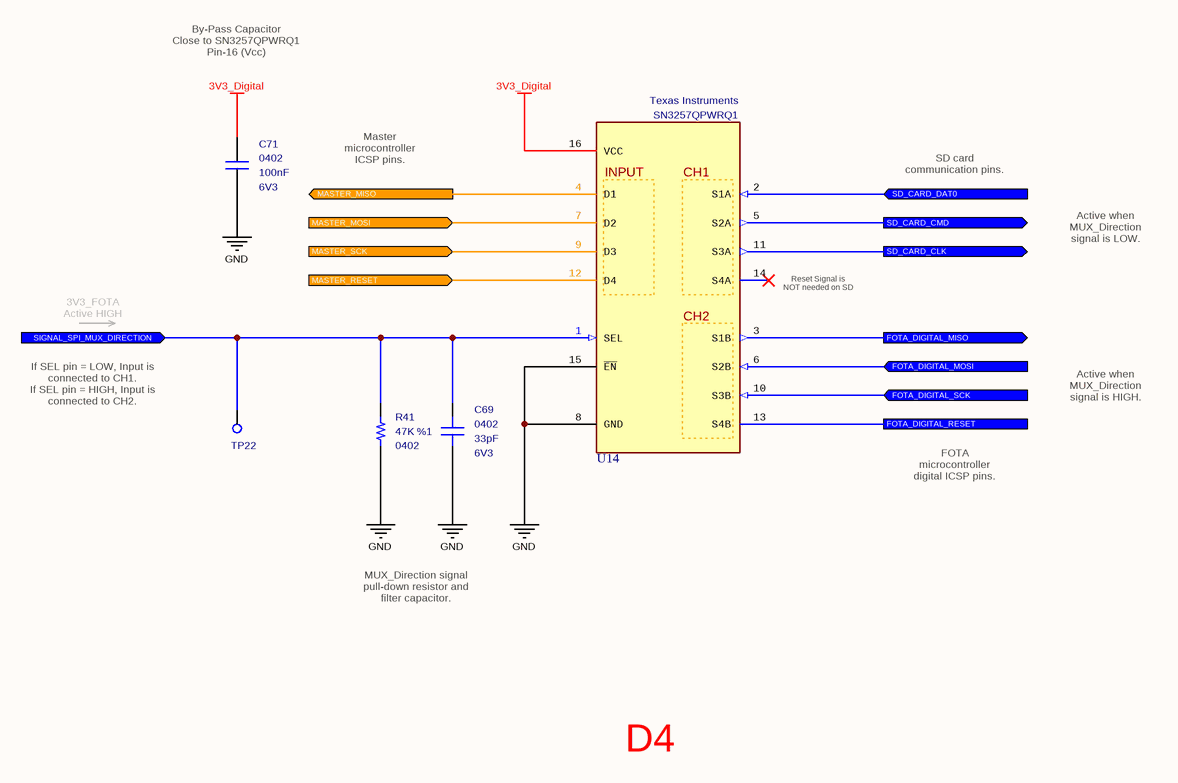
[diagram p8: SD Card Selection Multiplexer.SchDoc]

### Parts
C69  value 33pF  Case: 0402  Voltage: 6V3  [CAPACITOR_0402]  (hidden comment: Multilayer Ceramic Capacitor)
C71  value 100nF  Case: 0402  Voltage: 6V3  [CAPACITOR_0402]  (hidden comment: Multilayer Ceramic Capacitor)
R41  value 47K  Tolerance: %1  Case: 0402  [RESISTOR_0402]  (hidden comment: Thick Film Resistor)
TP22  PCB - Test Point  [Test_Pad - Hole]  (value not drawn)  (no BOM)
U14  Manufacturer_Part_Number: SN3257QPWRQ1  Manufacturer_Name: Texas Instruments  [TSSOP-16]  (hidden comment: SPI Switch IC)

### Ports
FOTA_DIGITAL_MISO (out), FOTA_DIGITAL_MOSI (in), FOTA_DIGITAL_RESET, FOTA_DIGITAL_SCK (in), MASTER_MISO (out), MASTER_MOSI (in), MASTER_RESET (in), MASTER_SCK (in), SD_CARD_CLK (out), SD_CARD_CMD (out), SD_CARD_DAT0 (in), SIGNAL_SPI_MUX_DIRECTION (in)

### Nets
3V3_Digital: C71.1 U14.16(VCC)
GND: C69.1 C71.2 R41.1 U14.8(GND) U14.15(~{EN})
FOTA_DIGITAL_MISO: U14.3(S1B) ; port FOTA_DIGITAL_MISO
FOTA_DIGITAL_MOSI: U14.6(S2B) ; port FOTA_DIGITAL_MOSI
FOTA_DIGITAL_RESET: U14.13(S4B) ; port FOTA_DIGITAL_RESET
FOTA_DIGITAL_SCK: U14.10(S3B) ; port FOTA_DIGITAL_SCK
MASTER_MISO: U14.4(D1) ; port MASTER_MISO
MASTER_MOSI: U14.7(D2) ; port MASTER_MOSI
MASTER_RESET: U14.12(D4) ; port MASTER_RESET
MASTER_SCK: U14.9(D3) ; port MASTER_SCK
NetC69_2: C69.2 R41.2 TP22.1 U14.1(SEL) ; port SIGNAL_SPI_MUX_DIRECTION
NetJ2_3: U14.5(S2A) ; port SD_CARD_CMD
NetJ2_5: U14.11(S3A) ; port SD_CARD_CLK
NetJ2_7: U14.2(S1A) ; port SD_CARD_DAT0

Not connected (* = marked no-connect by the designer): U14 14(S4A)*

### Notes on the sheet
- By-Pass Capacitor
  Close to SN3257QPWRQ1
  Pin-16 (Vcc)
- Master microcontroller ICSP pins.
- SD card communication pins.
- Active when MUX_Direction signal is LOW.
- 3V3_FOTA
  Active HIGH
- (near U14) Reset Signal is NOT needed on SD card.
- If SEL pin = LOW, Input is connected to CH1.
  If SEL pin = HIGH, Input is connected to CH2.
- Active when MUX_Direction signal is HIGH.
- FOTA microcontroller digital ICSP pins.
- MUX_Direction signal pull-down resistor and filter capacitor.
- D4
- Title
- Size:
- Date:
- A4
- Number:
- Time:
- Revision:
- Sheet
- of
- File:
- (in symbol IC - SN3257QPWRQ1) INPUT; CH1; CH2

### Library data of the parts
C69 = Capacitor - 33pF [0402-6V3]: as C30 on sheet FOTA MicroController Power Trigger; Height: 0.5mm; Mouser_Part_Number: 80-C0402C330J9RAUTO; Maximum Operating Temperature: +125; Minimum Operating Temperature: -55; ROHS: Yes; ComponentLink1Description: DataSheet; ComponentLink1URL: https://api.kemet.com/component-edge/download/datasheet/C0402C330J9RACAUTO.pdf; ComponentLink2Description: Mouser; ComponentLink2URL: https://www.mouser.com/Search/Refine.aspx?Keyword=80-C0402C330J9RAUTO; Supplier 1: Mouser; Supplier Part Number 1: 80-C0402C330J9RAUTO
C71 = Capacitor - 100nF [0402-6V3]: as C48 on sheet Master MicroController; Height: 0.25mm; Mouser_Part_Number: 581-04026D104KAT4A; ComponentLink1Description: Mouser; ComponentLink1URL: https://www.mouser.com.tr/ProductDetail/AVX/04026D104KAT4A?qs=sGAEpiMZZMs0AnBnWHyRQPg4iYkCw7IMED%2F4kpqgf7w%3D; ComponentLink2Description: DataSheet; ComponentLink2URL: https://www.mouser.com.tr/datasheet/2/40/cx5r-776519.pdf; ROHS: Yes; Maximum Operating Temperature: +85; Minimum Operating Temperature: -55; Supplier 1: Avnet; Supplier Part Number 1: 04026D104KAT4A
R41 = Resistor - 47K: as R20 on sheet FOTA MicroController Power Trigger; Height: 0.4mm; Mouser_Part_Number: 71-CRCW0402-47K-E3; ComponentLink1Description: DataSheet; ComponentLink1URL: https://www.mouser.com.tr/datasheet/2/427/dcrcwe3-1762152.pdf; ComponentLink2Description: Mouser; ComponentLink2URL: https://www.mouser.com.tr/ProductDetail/Vishay-Dale/CRCW040247K0FKED?qs=sGAEpiMZZMu61qfTUdNhG2DpbjADlD3GL%252B3h1elTxqU%3D; Supplier 1: Mouser; Supplier 2: Digi-Key; Supplier Part Number 1: 71-CRCW040247K0FKEDH; Supplier Part Number 2: 541-47.0KYCT-ND
TP22 = PCB - Test Point: Test Point
U14 = IC - SN3257QPWRQ1: Analogue Switch ICs 2:1 (SPDT), 4-channel switch with 1.8-V logic 16-TSSOP -40 to 125; Mouser Part Number: 595-SN3257QPWRQ1; ComponentLink1Description: DataSheet; ComponentLink1URL: http://www.ti.com/lit/ds/symlink/tca9546a.pdf; ComponentLink2Description: Mouser; ComponentLink2URL: https://eu.mouser.com/ProductDetail/Texas-Instruments/TCA9546APWR?qs=sGAEpiMZZMu0f%252BT2bkVfuqY85%252BzcFu6eZaMCXRqwDMg%3D; Minimum Operating Temperature: -40; Maximum Operating Temperature: +125; Supplier 1: Mouser; Supplier 2: Digi-Key; Supplier Part Number 1: 595-SN3257QPWRQ1; Supplier Part Number 2: 296-SN3257QPWRQ1CT-ND; Case: TSSOP-16

## Sheet SD Card Module.SchDoc: Micro SD Card Module
size A4; ApprovedBy: Mehmet Günce Akkoyun; CheckedBy: Mehmet Günce Akkoyun; Author: Mehmet Günce Akkoyun; CompanyName: Ovoo Electronics; DrawnBy: Mehmet Günce Akkoyun; Engineer: Mehmet Günce Akkoyun; Organization: Ovoo Electronics; Address1: Küçük Ýhsaniye Mah.; Address2: Mýzraklý Sok. No:15; Address3: Meram / Konya; Address4: Turkiye; DocumentNumber: AA005; Revision: B106AA; SheetNumber: 20; SheetTotal: 37
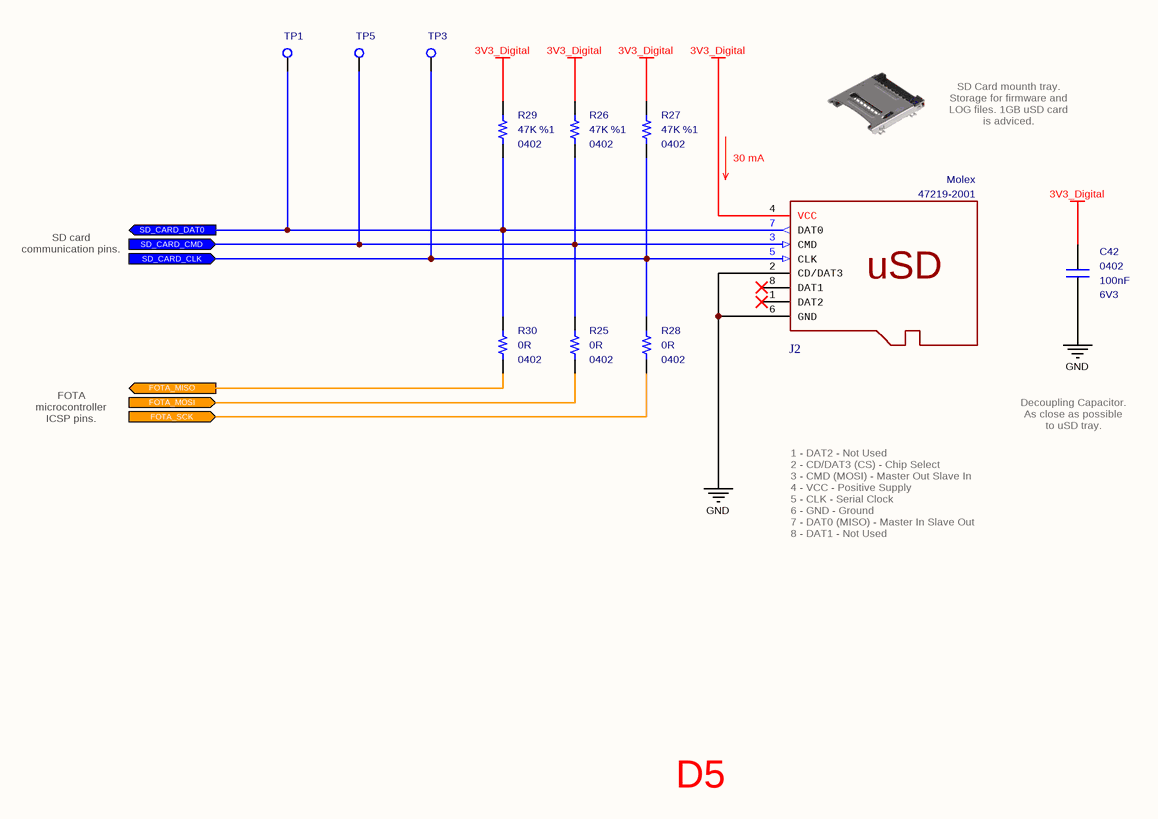
[diagram p9: SD Card Module.SchDoc]

### Parts
C42  value 100nF  Case: 0402  Voltage: 6V3  [CAPACITOR_0402]  (hidden comment: Multilayer Ceramic Capacitor)
J2  Manufacturer_Part_Number: 47219-2001  Manufacturer_Name: Molex  [Connector - SD Module]  (hidden comment: Memory Card Connectors)
R25  value 0R  Case: 0402  [RESISTOR_0402]  (hidden comment: Thick Film Resistor)
R26  value 47K  Tolerance: %1  Case: 0402  [RESISTOR_0402]  (hidden comment: Thick Film Resistor)
R27  value 47K  Tolerance: %1  Case: 0402  [RESISTOR_0402]  (hidden comment: Thick Film Resistor)
R28  value 0R  Case: 0402  [RESISTOR_0402]  (hidden comment: Thick Film Resistor)
R29  value 47K  Tolerance: %1  Case: 0402  [RESISTOR_0402]  (hidden comment: Thick Film Resistor)
R30  value 0R  Case: 0402  [RESISTOR_0402]  (hidden comment: Thick Film Resistor)
TP1  PCB - Test Point  [Test_Pad - Hole]  (value not drawn)  (no BOM)
TP3  PCB - Test Point  [Test_Pad - Hole]  (value not drawn)  (no BOM)
TP5  PCB - Test Point  [Test_Pad - Hole]  (value not drawn)  (no BOM)

### Ports
FOTA_MISO (out), FOTA_MOSI (in), FOTA_SCK (in), SD_CARD_CLK (in), SD_CARD_CMD (in), SD_CARD_DAT0 (out)

### Nets
3V3_Digital: C42.2 J2.4(VCC) R26.2 R27.2 R29.2
GND: C42.1 J2.2(CD/DAT3) J2.6(GND)
FOTA_MISO: R30.1 ; port FOTA_MISO
FOTA_MOSI: R25.1 ; port FOTA_MOSI
FOTA_SCK: R28.1 ; port FOTA_SCK
NetJ2_3: J2.3(CMD) R25.2 R26.1 TP5.1 ; port SD_CARD_CMD
NetJ2_5: J2.5(CLK) R27.1 R28.2 TP3.1 ; port SD_CARD_CLK
NetJ2_7: J2.7(DAT0) R29.1 R30.2 TP1.1 ; port SD_CARD_DAT0

Not connected (* = marked no-connect by the designer): J2 1(DAT2)* 8(DAT1)*

### Notes on the sheet
- 30 mA
- SD Card mounth tray. Storage for firmware and LOG files. 1GB uSD card is adviced.
- SD card communication pins.
- FOTA microcontroller ICSP pins.
- Decoupling Capacitor. As close as possible to uSD tray.
- 1 - DAT2 - Not Used
  2 - CD/DAT3 (CS) - Chip Select
  3 - CMD (MOSI) - Master Out Slave In
  4 - VCC - Positive Supply
  5 - CLK - Serial Clock
  6 - GND - Ground
  7 - DAT0 (MISO) - Master In Slave Out
  8 - DAT1 - Not Used
- D5
- Title
- Size:
- Date:
- A4
- Number:
- Time:
- Revision:
- Sheet
- of
- File:
- (in symbol Connector - SD Slot) uSD

### Library data of the parts
C42 = Capacitor - 100nF [0402-6V3]: as C48 on sheet Master MicroController; Height: 0.25mm; Mouser_Part_Number: 581-04026D104KAT4A; ComponentLink1Description: Mouser; ComponentLink1URL: https://www.mouser.com.tr/ProductDetail/AVX/04026D104KAT4A?qs=sGAEpiMZZMs0AnBnWHyRQPg4iYkCw7IMED%2F4kpqgf7w%3D; ComponentLink2Description: DataSheet; ComponentLink2URL: https://www.mouser.com.tr/datasheet/2/40/cx5r-776519.pdf; ROHS: Yes; Maximum Operating Temperature: +85; Minimum Operating Temperature: -55; Supplier 1: Avnet; Supplier Part Number 1: 04026D104KAT4A
J2 = Connector - SD Slot: Memory Card Connectors TFR READER (HINGE TYPE); Card Type: microSD; Mouser_Part_Number: 538-47219-2001; Supplier 1: Avnet; Supplier 2: Farnell; Supplier 3: Newark; Supplier 4: Digi-Key; Supplier Part Number 2: 2614940; Supplier Part Number 1: 0472192001; Supplier Part Number 3: 32T4523; Supplier Part Number 4: WM6698CT-ND
R25 R28 R30 = Resistor - 0R: Thick Film Resistors - SMD 1/16 W 0 Ohms; Manufacturer_Name: Vishay; Manufacturer_Part_Number: CRCW04020000Z0ED; Height: 0.4mm; Mouser_Part_Number: 71-CRCW0402-0-E3; ComponentLink1Description: DataSheet; ComponentLink1URL: https://www.mouser.com.tr/datasheet/2/427/dcrcwe3-1762152.pdf; ComponentLink2Description: Mouser; ComponentLink2URL: https://www.mouser.com.tr/ProductDetail/Vishay-Dale/CRCW04020000Z0ED?qs=sGAEpiMZZMu61qfTUdNhG2DpbjADlD3GG34cJb50zyg%3D; Supplier 1: Mouser; Supplier 2: Digi-Key; Supplier Part Number 1: 71-CRCW0402-0-E3; Supplier Part Number 2: 541-0.0JCT-ND
R26 R27 R29 = Resistor - 47K: as R20 on sheet FOTA MicroController Power Trigger; Height: 0.4mm; Mouser_Part_Number: 71-CRCW0402-47K-E3; ComponentLink1Description: DataSheet; ComponentLink1URL: https://www.mouser.com.tr/datasheet/2/427/dcrcwe3-1762152.pdf; ComponentLink2Description: Mouser; ComponentLink2URL: https://www.mouser.com.tr/ProductDetail/Vishay-Dale/CRCW040247K0FKED?qs=sGAEpiMZZMu61qfTUdNhG2DpbjADlD3GL%252B3h1elTxqU%3D; Supplier 1: Mouser; Supplier 2: Digi-Key; Supplier Part Number 1: 71-CRCW040247K0FKEDH; Supplier Part Number 2: 541-47.0KYCT-ND
TP1 TP3 TP5 = PCB - Test Point: Test Point